# Altium schematic sheet SCH002.SchDoc: Servo Interface
size A4; Date: 07-02-2024; DrawnBy: Nikhil Premjani; SheetNumber: 2; SheetTotal: 6; ModelNumber: EM411-202401-RMC001; ModelName: Remote Manipulation Controller
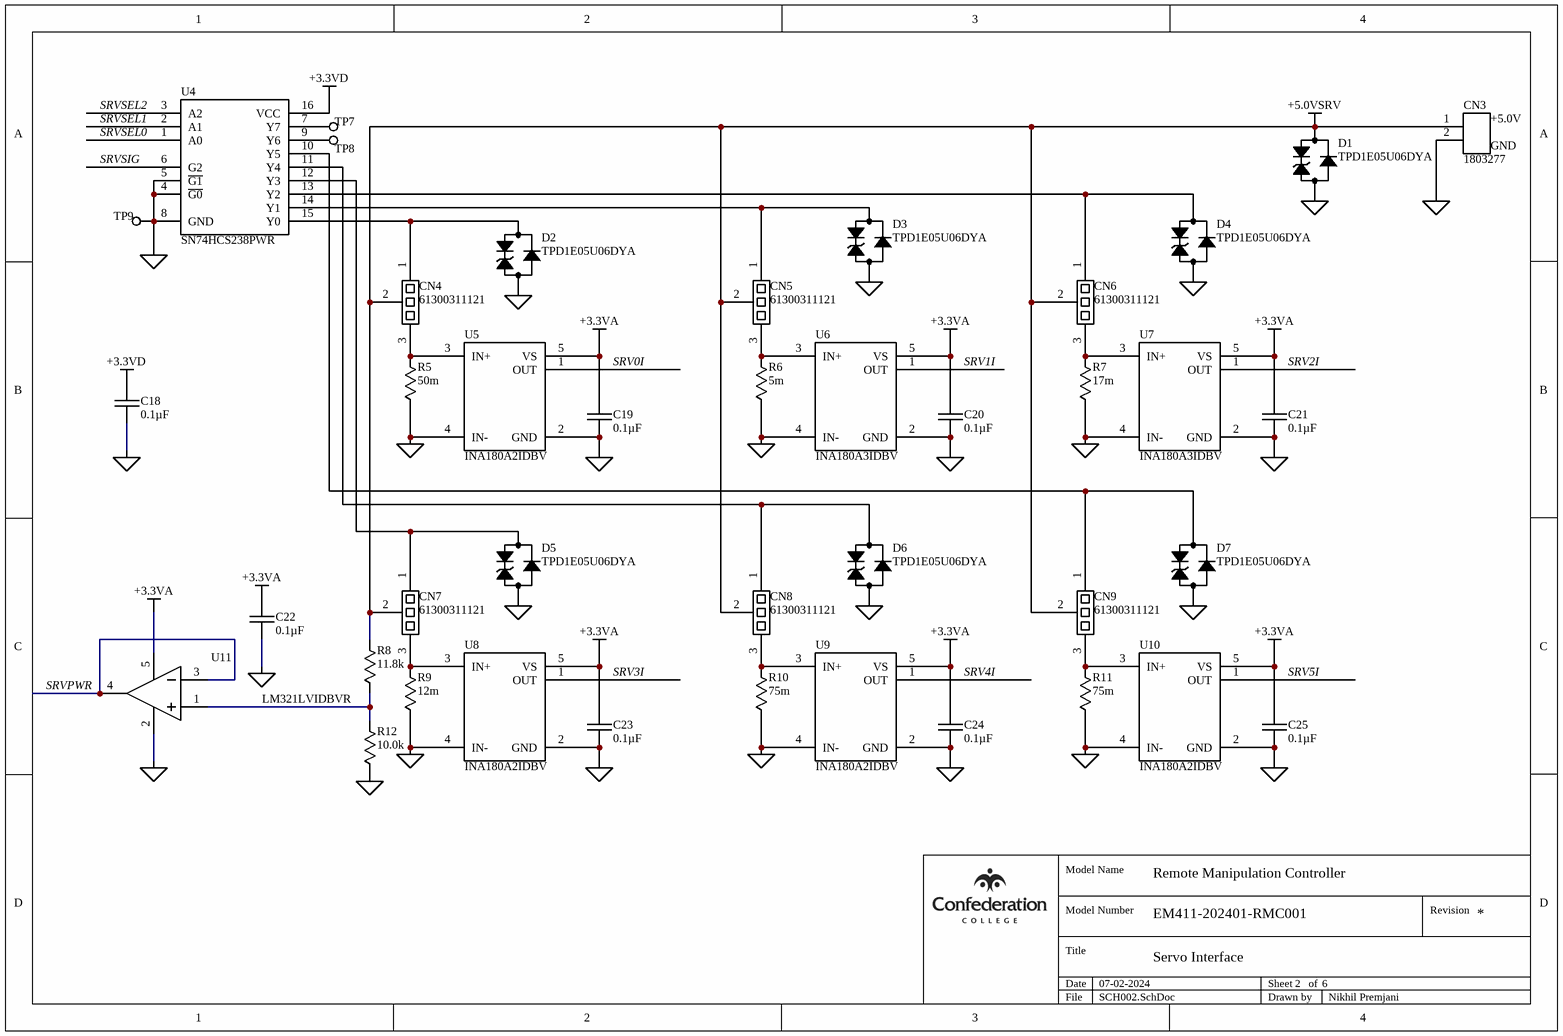
[diagram p0: SCH002.SchDoc]

## Parts
C18  0.1µF  [CAPC2012X14N]
C19  0.1µF  [CAPC2012X14N]
C20  0.1µF  [CAPC2012X14N]
C21  0.1µF  [CAPC2012X14N]
C22  0.1µF  [CAPC2012X14N]
C23  0.1µF  [CAPC2012X14N]
C24  0.1µF  [CAPC2012X14N]
C25  0.1µF  [CAPC2012X14N]
CN3  1803277  [PHOENIX_1803277]
CN4  61300311121  [WURTH_61300311121]
CN5  61300311121  [WURTH_61300311121]
CN6  61300311121  [WURTH_61300311121]
CN7  61300311121  [WURTH_61300311121]
CN8  61300311121  [WURTH_61300311121]
CN9  61300311121  [WURTH_61300311121]
D1  TPD1E05U06DYA  [SODFL160X77-2N]
D2  TPD1E05U06DYA  [SODFL160X77-2N]
D3  TPD1E05U06DYA  [SODFL160X77-2N]
D4  TPD1E05U06DYA  [SODFL160X77-2N]
D5  TPD1E05U06DYA  [SODFL160X77-2N]
D6  TPD1E05U06DYA  [SODFL160X77-2N]
D7  TPD1E05U06DYA  [SODFL160X77-2N]
R5  50m  [RESC2012X08N]
R6  5m  [RESC2012X08N]
R7  17m  [RESC2013X05N]
R8  11.8k  [RESC2012X06N]
R9  12m  [RESC2012X08N]
R10  75m  [RESC2012X08N]
R11  75m  [RESC2012X08N]
R12  10.0k  [RESC2012X06N]
TP7  Test Point  [TP100]  (value not drawn)  (no BOM)
TP8  Test Point  [TP100]  (value not drawn)  (no BOM)
TP9  Test Point  [TP100]  (value not drawn)  (no BOM)
U4  SN74HCS238PWR  [TSOP65P640X120-16N]
U5  INA180A2IDBV  [SOT95P280X145-5N]
U6  INA180A3IDBV  [SOT95P280X145-5N]
U7  INA180A3IDBV  [SOT95P280X145-5N]
U8  INA180A2IDBV  [SOT95P280X145-5N]
U9  INA180A2IDBV  [SOT95P280X145-5N]
U10  INA180A2IDBV  [SOT95P280X145-5N]
U11  LM321LVIDBVR  [SOT95P280X145-5N]

## Nets
+3.3VA: C19.1 C20.1 C21.1 C22.1 C23.1 C24.1 C25.1 U5.5(VS) U6.5(VS) U7.5(VS) U8.5(VS) U9.5(VS) U10.5(VS) U11.5(V+)
+3.3VD: C18.1 U4.16(VCC)
+5.0VSRV: CN3.1 CN4.2 CN5.2 CN6.2 CN7.2 CN8.2 CN9.2 D1.K R8.2
GND: C18.2 C19.2 C20.2 C21.2 C22.2 C23.2 C24.2 C25.2 CN3.2 D1.A D2.A D3.A D4.A D5.A D6.A D7.A R5.1 R6.1 R7.1 R9.1 R10.1 R11.1 R12.1 TP9.1 U4.4(~{G0}) U4.5(~{G1}) U4.8(GND) U5.2(GND) U5.4(IN-) U6.2(GND) U6.4(IN-) U7.2(GND) U7.4(IN-) U8.2(GND) U8.4(IN-) U9.2(GND) U9.4(IN-) U10.2(GND) U10.4(IN-) U11.2(V-)
SRV0I: U5.1(OUT)
SRV1I: U6.1(OUT)
SRV2I: U7.1(OUT)
SRV3I: U8.1(OUT)
SRV4I: U9.1(OUT)
SRV5I: U10.1(OUT)
SRVPWR: U11.3(IN-) U11.4(OUT)
SRVSEL0: U4.1(A0)
SRVSEL1: U4.2(A1)
SRVSEL2: U4.3(A2)
SRVSIG: U4.6(G2)
NetCN4_1: CN4.1 D2.K U4.15(Y0)
NetCN4_3: CN4.3 R5.2 U5.3(IN+)
NetCN5_1: CN5.1 D3.K U4.14(Y1)
NetCN5_3: CN5.3 R6.2 U6.3(IN+)
NetCN6_1: CN6.1 D4.K U4.13(Y2)
NetCN6_3: CN6.3 R7.2 U7.3(IN+)
NetCN7_1: CN7.1 D5.K U4.12(Y3)
NetCN7_3: CN7.3 R9.2 U8.3(IN+)
NetCN8_1: CN8.1 D6.K U4.11(Y4)
NetCN8_3: CN8.3 R10.2 U9.3(IN+)
NetCN9_1: CN9.1 D7.K U4.10(Y5)
NetCN9_3: CN9.3 R11.2 U10.3(IN+)
NetR8_1: R8.1 R12.2 U11.1(IN+)
NetTP7_1: TP7.1 U4.7(Y7)
NetTP8_1: TP8.1 U4.9(Y6)

## Notes on the sheet
- (near CN3) +5.0V
- (near CN3) GND
- Model Number
- Model Name
- Revision
- Title
- Date
- Sheet
- of
- File
- Drawn by

## Library data of the parts
C18-C25 = UMK212B7104KGHT: 0.1µF/50V/±10% X7R Ceramic Chip Capacitor; Manufacturer: Taiyo Yuden; PartNumber: UMK212B7104KGHT
CN3 = 1803277: MC 1,5/2G-3,81 Pluggable Terminal Block 2 Pos 3.81mm pitch Through Hole Header; Manufacturer: Phoenix Contact; PartNumber: 1803277
CN4-CN9 = 61300311121: Connector Header Through Hole 3 position 0.100" (2.54mm); Manufacturer: Wurth Elektronik; PartNumber: 61300311121
D1-D7 = TPD1E05U06DYA: Single-Channel ESD Protection Diode; Manufacturer: Texas Instruments; PartNumber: TPD1E05U06DYA
R5 = ERJ-6BWFR050V: 50m, 1%, 0.5W Thick Film Chip Resistor; Manufacturer: Panasonic; PartNumber: ERJ-6BWFR050V
R6 = CRF0805-FZ-R005ELF: 5m, 1%, 0.5W Thick Film Chip Resistor; Manufacturer: Bourns; PartNumber: CRF0805-FZ-R005ELF
R7 = WSLP0805R0170FEB: 17m, 1%, 0.5W Thick Film Chip Resistor; Manufacturer: Vishay Dale; PartNumber: WSLP0805R0170FEB
R8 = CR0805-FX-1182ELF: 11.8k, 1%, 0.125W Thick Film Chip Resistor; Manufacturer: Bourns; PartNumber: CR0805-FX-1182ELF
R9 = ERJ-6BWFR012V: 12m, 1%, 0.5W Thick Film Chip Resistor; Manufacturer: Panasonic; PartNumber: ERJ-6BWFR012V
R10 R11 = ERJ-6BWFR075V: 75m, 1%, 0.5W Thick Film Chip Resistor; Manufacturer: Panasonic; PartNumber: ERJ-6BWFR075V
R12 = CR0805-FX-1002ELF: 10.0k, 1%, 0.125W Thick Film Chip Resistor; Manufacturer: Bourns; PartNumber: CR0805-FX-1002ELF
TP7-TP9 = TP3: Test Point, Surface Mount, 3 mm; Manufacturer: Confederation College; PartNumber: N/A
U4 = SN74HCS238PWR: 3-to 8-Line Decoder/Demultiplexer with Schmitt-Trigger Inputs; Manufacturer: Texas Instruments; PartNumber: SN74HCS238PWR
U5 U8-U10 = INA180A2IDBV: Voltage Output, Current-Sense Amplifiers, Gain 50; Manufacturer: Texas Instruments; PartNumber: INA180A2IDBV
U6 U7 = INA180A3IDBV: Voltage Output, Current-Sense Amplifiers, Gain 100; Manufacturer: Texas Instruments; PartNumber: INA180A3IDBV
U11 = LM321LVIDBVR: Industry Standard, Low Voltage Operational Amplifier; Manufacturer: Texas Instruments; PartNumber: LM321LVIDBVR